# Altium schematic sheet 24V_Supply.SchDoc: 24V Power Jack Input with PMOS Switch
size A4; DocumentNumber: 3; SheetNumber: 3; SheetTotal: 16
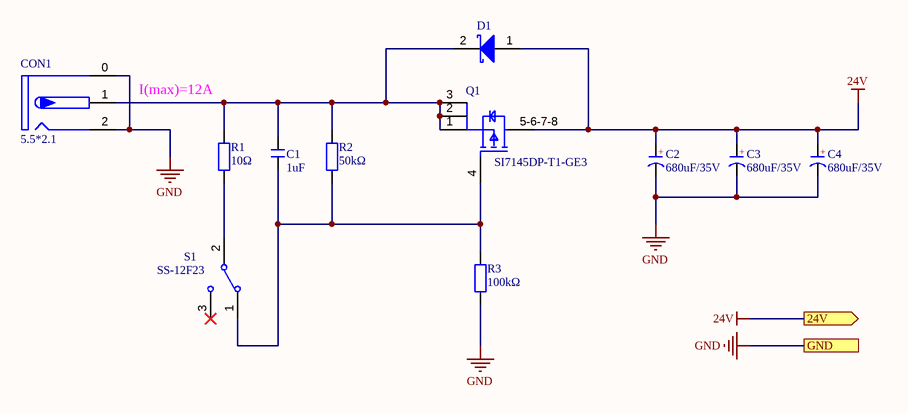
[diagram p0: 24V_Supply.SchDoc]

## Parts
C1  1uF  [C 0603_L]
C2  680uF/35V  [CM G(12.5*13.5)]
C3  680uF/35V  [CM G(12.5*13.5)]
C4  680uF/35V  [CM G(12.5*13.5)]
CON1  5.5*2.1  [DC-005P]
D1  B530C-13-F  [DIOD-SMC-2_V]  (value not drawn)
Q1  SI7145DP-T1-GE3  [FP-S17-0173-SINGLE-MFG]
R1  10Ω  [R 0603_L]
R2  50kΩ  [R 0603_L]
R3  100kΩ  [R 0603_L]
S1  SS-12F23  [SS-SG2]

## Ports
24V (out), GND

## Nets
24V: C2.1(A) C3.1(A) C4.1(A) D1.1(A) Q1.5-6-7-8(D) ; port 24V
GND: C2.2(K) C3.2(K) C4.2(K) CON1.0 CON1.2 R3.1 ; port GND
NetC1_1: C1.1 Q1.4(G) R2.1 R3.2 S1.1
NetC1_2: C1.2 CON1.1 D1.2(K) Q1.1(S) Q1.2(S) Q1.3(S) R1.2 R2.2
NetR1_1: R1.1 S1.2

Not connected (* = marked no-connect by the designer): S1 3*

## Notes on the sheet
- I(max)=12A
- Title
- FileName:
- Version:
- Date:
- Project
- Designed By:
- Descriptions:
- Sheet:
- of
- (in symbol CE_SMD) +

## Library data of the parts
C1 = C: 贴片电容; BOM名称: 无极性贴片电容; 淘宝ID: 封装库来自淘宝 ID：黄晶宝石; 联系售后，技术支持: https://shop463601444.taobao.com; 唯一出售店铺网址: https://shop463601444.taobao.com
C2-C4 = CE_SMD: 贴片电解电容; 版权归属: 封装库来自淘宝 ID：黄晶宝石; BOM名称: 贴片电解电容; 联系售后: https://shop463601444.taobao.com
CON1 = DC-005P: 带屏蔽DC电源接口 / *LCID: C3001296; BOM名称: 带屏蔽DC电源接口; 学习资源: https://shop463601444.taobao.com
D1 = CMP-1693-00001-3: Surface Mount Schottky Barrier Rectifier, 5 A, 0.55 V, -55 to 150 degC, 2-Pin SMD, RoHS, Tape and Reel / *LCID: C110488; Mounting Technology: Surface Mount; DatasheetVersion: Rev. 16-2; ComponentLink2URL: http://www.diodes.com/_files/datasheets/ds13012.pdf; ComponentLink1Description: Manufacturer URL; ComponentLink1URL: http://www.diodes.com/; ComponentLink2Description: Datasheet; PartNumber: B530C-13-F; PackageDescription: 2-Pin Surface Mount Device, Body 5.905 x 6.855 mm; Max Operating Temperature: 125 degC; Radiation Hardening: No; Mount: Surface Mount; Height: 2.3 mm; REACH SVHC: No SVHC; Packaging: Tape and Reel; Min Operating Temperature: -55 degC; Length: 7.11 mm; Package Quantity: 3000; Width: 6.22 mm; Case/Package: SMC; Pins: 2; RoHSCompliant: True
Q1 = CMP-2000-07061-2: MOSFET P-CH 30V 60A PPAK SO-8 / *LCID: C725172; Manufacturer: Vishay; Gate Charge At Vgs: 275nC @ -10V; Turn On Delay Time: 27ns; Number Of P Channels: 1; Max Forward Diode Voltage: -1.1V; Pulse Drain Current: -100A; Gate To Source Voltage: 20V; Threshold Vgs Max: -2.3V; Drain To Source Resistance: 0.0021Ω; Threshold Vgs Min: -1V; Input Capacitace At Vds: 15660pF @ -15V; Power Dissipation: 6.25W; Standoff Height: 0mm; Continuous Drain Current: -36.5A; Max Junction Temp: +150°C; Typ Forward Diode Voltage: -0.69V; Turn Off Delay Time: 130ns; Drain To Source Breakdown Voltage: -30V; Reverse Recovery Time: 42ns; Depletion Mode: False; Reverse Recovery Charge: 44nC; Rthja Max: 15°C/W; Transconductance: 110S; Temperature Range Low: -55°C; Manufacturer Part Number: SI7145DP-T1-GE3; Height: 1.17mm; Automotive: No; Device Class L2: Transistors; Octopart: https://octopart.com/si7145dp-t1-ge3-vishay-42623172; RoHS: TRUE; Device Class L3: MOSFETs; ComponentLink2URL: http://www.vishay.com/docs/64814/si7145dp.pdf; Mouser Description: Single P-Channel 30 V 2.6 mOhms Surface Mount Power Mosfet - PowerPAK SO-8; ComponentLink2Description: Datasheet; Category: Trans; Digikey Description: MOSFET P-CH 30V 60A PPAK SO-8; Number Of Channels: 1; Package: S17-0173-SINGLE; Device Class L1: Discrete Semiconductors; Drain To Source Voltage: -30V; Temperature Range High: +150°C; Temperature: -55°C to +150°C; Lead Free: Yes
R1-R3 = R: 贴片电阻; 版权归属: 来自淘宝 ID：黄晶宝石; 封装库来自淘宝卖家 ID：黄晶宝石: 其他店铺购入均为盗版，不享受售后技术支持服务，请立即申请退款; BOM名称: 贴片电阻; 联系售后: https://shop463601444.taobao.com
S1 = SSW-1P: 1路波动开关 / *LCID: C480340; BOM名称: 波动开关; 版权归属: 封装库来自淘宝 ID：黄晶宝石; 学习资源: https://shop463601444.taobao.com